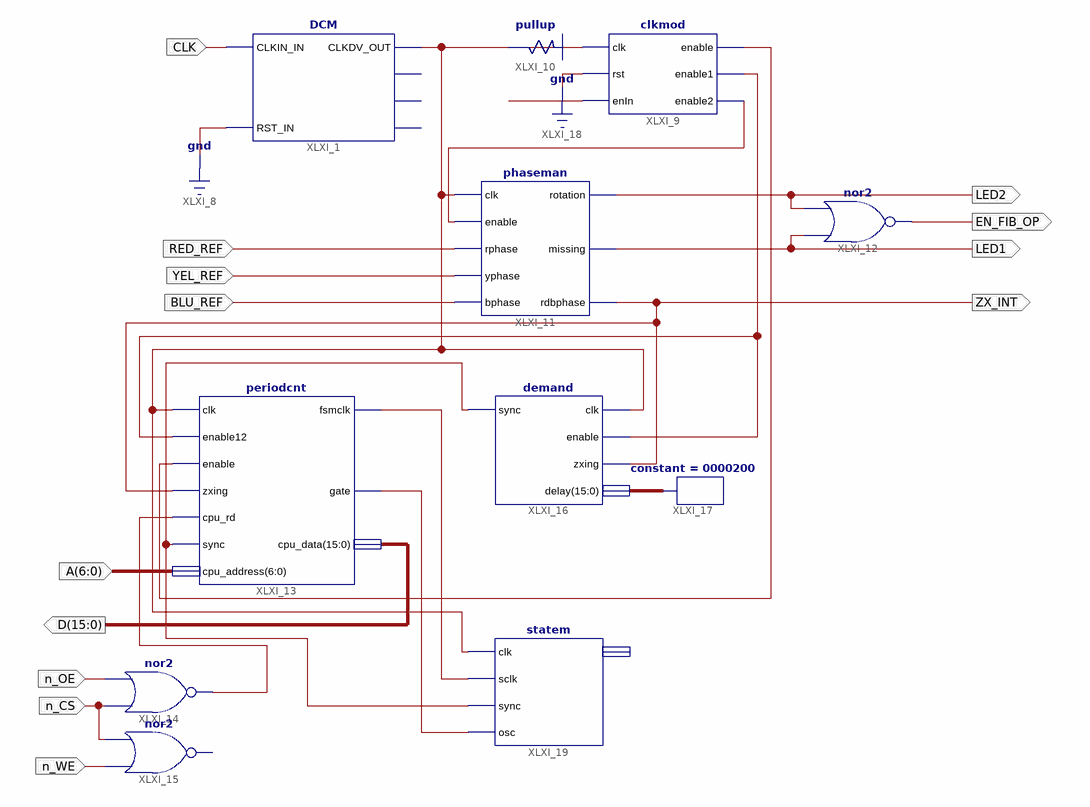
[diagram p0: schematic sheet 1]
// Xilinx ISE schematic Top_PC2118.sch (spartan3e) as structural Verilog: 11 symbols, 13 ports
module Top_PC2118 (
  input  CLK,
  input  RED_REF,
  input  YEL_REF,
  input  BLU_REF,
  input  n_CS,
  input  n_OE,
  input  n_WE,
  input  [6:0] A,
  output LED2,
  output LED1,
  output EN_FIB_OP,
  output ZX_INT,
  output [15:0] D
);

  wire XLXN_23, XLXN_40, XLXN_44, XLXN_56, XLXN_74, XLXN_89, XLXN_100, XLXN_110, XLXN_111;
  wire [15:0] XLXN_70;

  DCM XLXI_1 (.CLKIN_IN(CLK), .RST_IN(1'b0), .CLKDV_OUT(XLXN_23));  // open: CLKIN_IBUFG_OUT, CLK0_OUT, LOCKED_OUT
  clkmod XLXI_9 (.clk(XLXN_23), .rst(1'b0), .enIn(XLXN_100), .enable(XLXN_44), .enable1(XLXN_40), .enable2(XLXN_89));
  \pullup  XLXI_10 (.O(XLXN_100));
  phaseman XLXI_11 (
    .clk(XLXN_23), .enable(XLXN_89), .rphase(RED_REF), .yphase(YEL_REF), .bphase(BLU_REF), .rotation(LED2),
    .missing(LED1), .rdbphase(ZX_INT));
  nor XLXI_12 (EN_FIB_OP, LED1, LED2);
  periodcnt XLXI_13 (
    .clk(XLXN_23), .enable12(XLXN_40), .enable(XLXN_44), .zxing(ZX_INT), .cpu_rd(XLXN_56), .sync(XLXN_74),
    .cpu_address(A), .fsmclk(XLXN_110), .gate(XLXN_111), .cpu_data(D));
  nor XLXI_14 (XLXN_56, n_CS, n_OE);
  // nor2 XLXI_15 has open pins: I0=n_WE, I1=n_CS, O=open
  demand XLXI_16 (.clk(XLXN_23), .enable(XLXN_40), .zxing(ZX_INT), .delay(XLXN_70), .sync(XLXN_74));
  constant #(.CValue("0000200")) XLXI_17 (.O(XLXN_70));
  statem XLXI_19 (.clk(XLXN_23), .sclk(XLXN_110), .sync(XLXN_74), .osc(XLXN_111));  // open: firing
endmodule
